# EAGLE design Ee_33_Roco_43936_NEXT18_J1_022_02_02 (EAGLE 5.10)
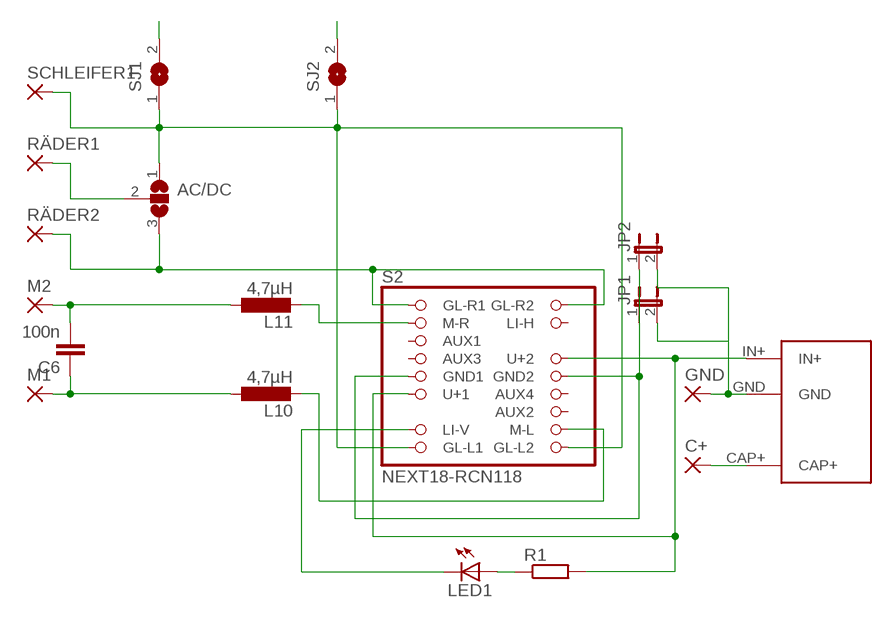
[diagram p0: schematic, sheet 1]

## Parts
AC/DC  SJ2W1  [SJ_2.1]
C6  100n  C-EUC0603K  [C0603K]
C+  1,6/0,8  [1,6/0,8]
GND  1,6/0,8  [1,6/0,8]
JP1  JP1E2,00R  [JP1_2R]
JP2  JP1E2,00R  [JP1_2R]
L10  4,7µH  L-EUL1212W  [L1212W]
L11  4,7µH  L-EUL1212W  [L1212W]
LED1  LEDCHIPLED_0603  [CHIPLED_0603]
M1  SMD-LONG2,54-5,08  [SMD2,54-5,08]
M2  SMD-LONG2,54-5,08  [SMD2,54-5,08]
R1  R-EU_R0603  [R0603]
RÄDER1  SMD-LONG1,27-2,54  [SMD1,27-2,54]
RÄDER2  SMD-LONG1,27-2,54  [SMD1,27-2,54]
S2  NEXT18-RCN118  [NEXT18]
SCHLEIFER1  SMD-LONG1,27-2,54  [SMD1,27-2,54]
SJ1  SJSS  [SJSS]
SJ2  SJSS  [SJSS]
U$1  PWR_CAPTS  [POWER_CAP_S]

## Nets
BL: L10.2 S2.P11(M-L)
N$1: C6.1 L10.1 M1.1(P)
N$2: C6.2 L11.1 M2.1(P)
N$3: JP1.1 JP2.1 S2.P5(GND1) S2.P14(GND2)
N$4: R1.2 S2.P6(U+1) S2.P15(U+2) U$1.IN+
N$5: L11.2 S2.P2(M-R)
N$6: GND.1(P) JP1.2 JP2.2 U$1.GND
N$7: LED1.A R1.1
N$8: C+.1(P) U$1.CAP+
N$9: LED1.C S2.P8(LI-V)
RÄDER1: AC/DC.2 RÄDER1.1(P)
RÄDER2: AC/DC.3 RÄDER2.1(P) S2.P1(GL-R1) S2.P18(GL-R2)
SCHLEIFER: AC/DC.1 S2.P9(GL-L1) S2.P10(GL-L2) SCHLEIFER1.1(P) SJ1.1 SJ2.1
SCHLEIFER1: SJ1.2
SCHLEIFER2: SJ2.2
Unconnected: S2.P3(AUX1) S2.P4(AUX3) S2.P12(AUX2) S2.P13(AUX4) S2.P17(LI-H)

## Library data of the parts
AC/DC = jumper:SJ2
C6 = rcl:C-EU: CAPACITOR, European symbol
C+ GND = wirepad:1,6/0,8: THROUGH-HOLE PAD
JP1 JP2 = jumper:JP1E: JUMPER
L10 L11 = rcl:L-EU: INDUCTOR, European symbol
LED1 = led:LED: LED OSRAM: - CHIPLED LG R971, LG N971, LY N971, LG Q971, LY Q971, LO R971, LY R971 LH N974, LH R974 LS Q976, LO Q976, LY Q976 LO Q996 - Hyper CHIPLED LW Q18S LB Q993, LB Q99A, LB R99A - SideLED LS A670, LO A670, LY A670, LG A670, LP A670 LB A673, LV A673, LT A673, LW A673 LH A674 LY A675 LS A676, LA A676, LO A676, LY A676, LW A676 LS A679, LY A679, LG A679 - Hyper Micro SIDELED® LS Y876, LA Y876, LO Y876, LY Y876 LT Y87S - SmartLED LW L88C, LW L88S LB L89C, LB L89S, LG L890 LS L89K, LO L89K, LY L89K LS L896, LA L896, LO L896, LY L896 - TOPLED LS T670, LO T670, LY T670, LG T670, LP T670 LSG T670, LSP T670, LSY T670, LOP T670, LYG T670 LG T671, LOG T671, LSG T671 LB T673, LV T673, LT T673, LW T673 LH T674 LS T676, LA T676, LO T676, LY T676, LB T676, LH T676, LSB T676, LW T676 LB T67C, LV T67C, LT T67C, LS T67K, LO T67K, LY T67K, LW E67C LS E67B, LA E67B, LO E67B, LY E67B, LB E67C, LV E67C, LT E67C LW T67C LS T679, LY T679, LG T679 LS T770, LO T770, LY T770, LG T770, LP T770 LB T773, LV T773, LT T773, LW T773 LH T774 LS E675, LA E675, LY E675, LS T675 LS T776, LA T776, LO T776, LY T776, LB T776 LHGB T686 LT T68C, LB T68C - Hyper Mini TOPLED® LB M676 - Mini TOPLED Santana® LG M470 LS M47K, LO M47K, LY M47K Source: http://www.osram.convergy.de LUXEON: - LUMILED® LXK2-PW12-R00, LXK2-PW12-S00, LXK2-PW14-U00, LXK2-PW14-V00 LXK2-PM12-R00, LXK2-PM12-S00, LXK2-PM14-U00 LXK2-PE12-Q00, LXK2-PE12-R00, LXK2-PE12-S00, LXK2-PE14-T00, LXK2-PE14-U00 LXK2-PB12-K00, LXK2-PB12-L00, LXK2-PB12-M00, LXK2-PB14-N00, LXK2-PB14-P00, LXK2-PB14-Q00 LXK2-PR12-L00, LXK2-PR12-M00, LXK2-PR14-Q00, LXK2-PR14-R00 LXK2-PD12-Q00, LXK2-PD12-R00, LXK2-PD12-S00 LXK2-PH12-R00, LXK2-PH12-S00 LXK2-PL12-P00, LXK2-PL12-Q00, LXK2-PL12-R00 Source: www.luxeon.com KINGBRIGHT: KA-3528ASYC Source: www.kingbright.com
M1 M2 RÄDER1 RÄDER2 SCHLEIFER1 = wirepad:SMD-LONG
R1 = rcl:R-EU_: RESISTOR, European symbol
S2 = pinhead:NEXT18
SJ1 SJ2 = jumper:SJ: SMD solder JUMPER
U$1 = pinhead:PWR_CAP

## Board
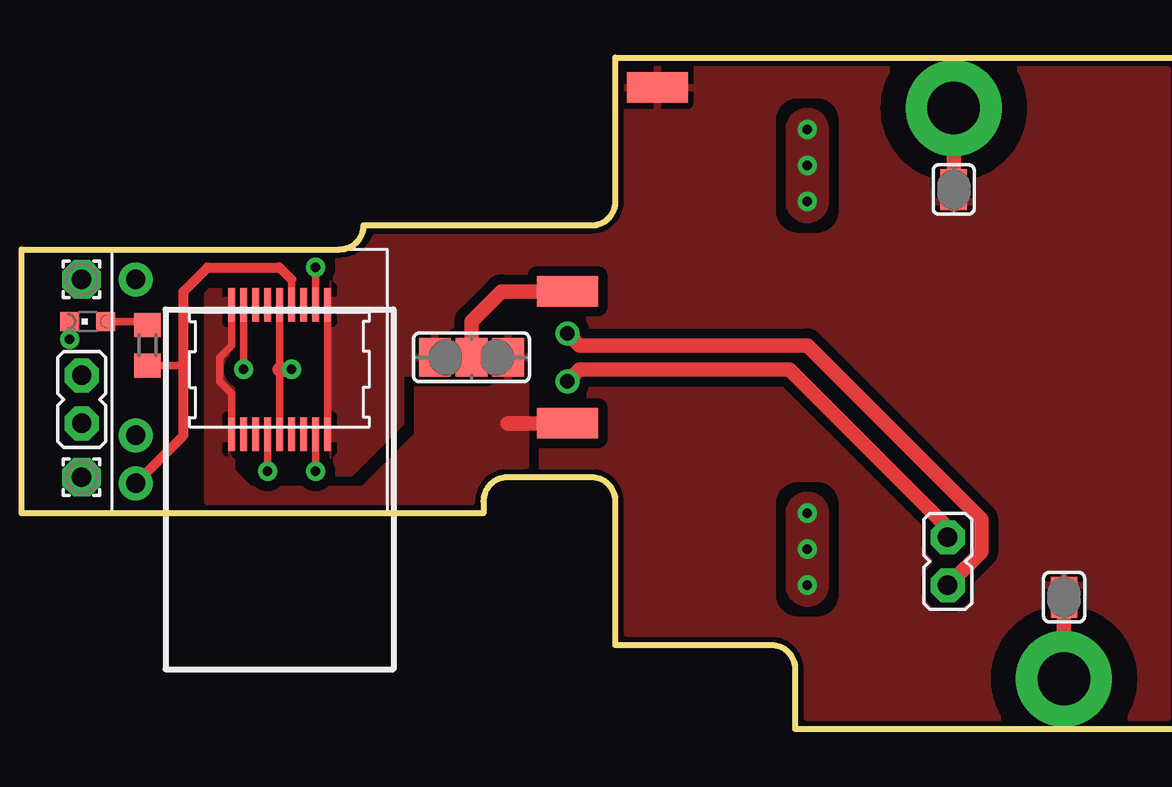
[diagram p1: board, top side]
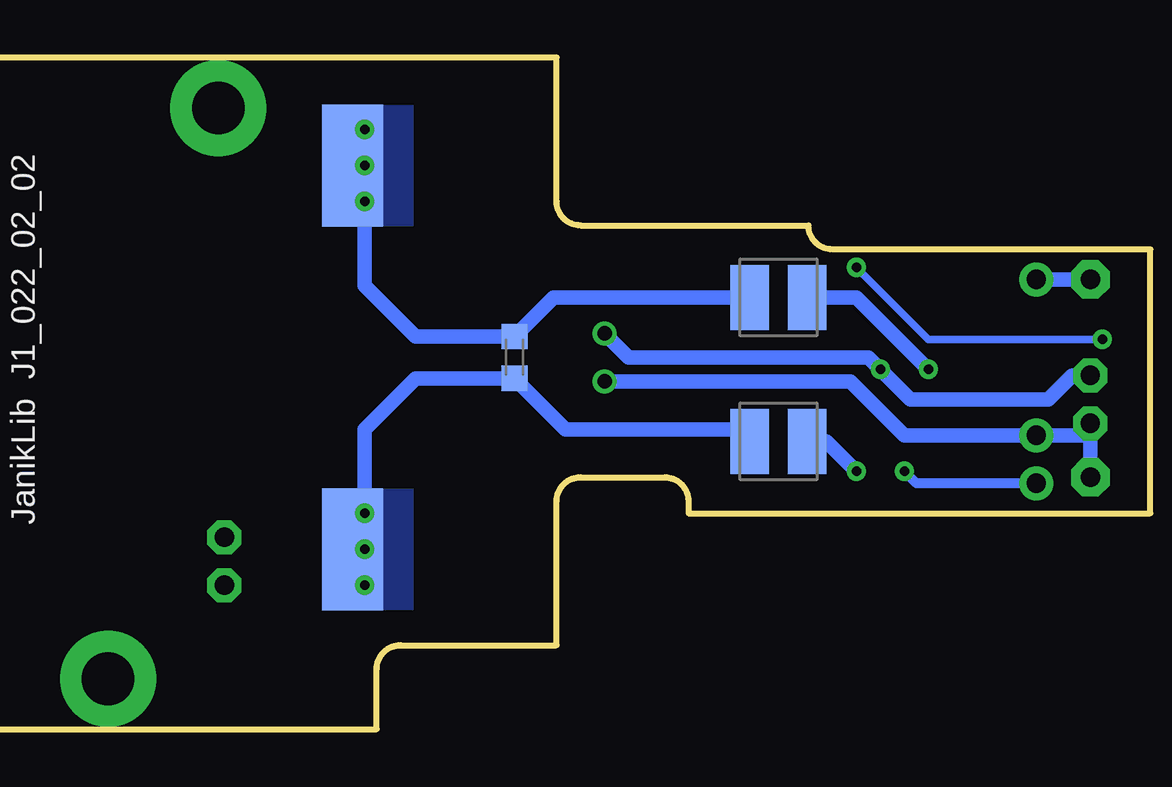
[diagram p2: board, bottom side, seen from below]

No outline drawn. Coordinates in mm, seen from the top.
Copper layers (1*16): Top 0.035mm / dielectric 1.5mm / Bottom 0.035mm
Design rules "default *": minimum track width 10mil, minimum drill 0.4mm, track to track 8mil, track to pad 8mil, pad to pad 8mil, via to via 8mil, smd to smd 8mil, copper to edge 40mil, drill to drill 8mil, minimum pad ring 10mil, minimum via ring 8mil, stop-mask expansion 4mil, vias tented up to drill 0mil, thermal gap 10mil
bKeepout: area 46.8,4 to 48.2,24; area 29.2,9 to 46.8,22; area 1.2,12.5 to 29.2,17.5
tRestrict: area 41,-0.4 to 46,4.6; area 36.4,23.4 to 41.4,28.4; area 11.2,13.2 to 12.2,16.8
Milling: 18 lines

### Footprints (pad centres in the part's own frame; a part is rotated, then mirrored left to right if it is on the bottom)
SJ_2.1 = smd 1.321 x 1.6: 1 -1.524,0; 2 0,0; 3 1.524,0
C0603K = smd 1.05 x 1.08: 1 -0.875,0; 2 0.875,0
1,6/0,8 = drill 0.813 pad 1.6 octagon: 1 0,0
JP1_2R = drill 0.8 pad 1.422 octagon: 1 0,-1; 2 0,1
L1212W = smd 1.6 x 2.7: 1 -1.2,0; 2 1.2,0
CHIPLED_0603 = smd 0.8 x 0.8: A 0,-0.75; C 0,0.75
SMD2,54-5,08 = smd 2.54 x 5.08: 1 0,0
R0603 = smd 1 x 1.1: 1 -0.85,0; 2 0.85,0
SMD1,27-2,54 = smd 1.27 x 2.54: 1 0,0
NEXT18 = smd 0.3 x 1.4: P1 -2,2.7; P2 -1.5,2.7; P3 -1,2.7; P4 -0.5,2.7; P5 0,2.7; P6 0.5,2.7; P7 1,2.7; P8 1.5,2.7; P9 2,2.7; P10 2,-2.7; P11 1.5,-2.7; P12 1,-2.7; P13 0.5,-2.7; P14 0,-2.7; P15 -0.5,-2.7; P16 -1,-2.7; P17 -1.5,-2.7; P18 -2,-2.7
SJSS = smd 0.7 x 1.1: 1 -0.5,0; 2 0.5,0
POWER_CAP_S = drill 0.8 pad 1.422 round: CAP+ 0,-6.5; GND 0,0; IN+ 0,2

### Placement (x,y rotation side)
AC/DC  18.75,15.5 0 top
C6  26.5,15.5 90 bottom
C+  2.5,18.75 0 top
GND  2.5,10.5 0 top
JP1  2.5,13.75 180 top
JP2  38.6,7 0 top
L10  15.5,12 0 bottom
L11  15.5,18 0 bottom
LED1  2.75,17 90 top
M1  33.25,7.5 0 bottom
M2  33.25,23.5 0 bottom
R1  5.25,16 270 top
RÄDER1  22.75,18.25 270 top
RÄDER2  22.75,12.75 90 top
S2  10.75,15 0 top
SCHLEIFER1  26.5,26.75 270 top
SJ1  43.45,5.5 270 top
SJ2  38.85,22.5 90 top
U$1  4.75,12.25 180 top

### Tracks (layer width: path | path; a pad name or v marks a point on that pad's centre or on a via)
BL  (via drill 0.4)
  Top 0.305: S2.P11 v12.25,10.75
  Bottom 0.61: v12.25,10.75 13.5,12 L10.2
N$1  (via drill 0.4)
  Bottom 0.61: v32.75,7.5 v32.75,9 32.75,12.5 30.62,14.62 C6.1 24.38,12.5 17.2,12.5 L10.1 | v32.75,7.5 v32.75,6 | v32.75,7.5 M1.1
  pour Top: 32,9 arc-90 32.75,9.75 arc-90 33.5,9 33.5,6 arc-90 32.75,5.25 arc-90 32,6
  pour Bottom (no thermals): 32.25,10 30.75,10 30.75,5 32.25,5
N$2  (via drill 0.4)
  Bottom 0.61: 32.75,23 v32.75,22 32.75,18.5 30.62,16.38 C6.2 24.88,18 L11.1 | 32.75,23 v32.75,23.5 v32.75,25 | 32.75,23 M2.1
  pour Top: 33.5,25 arc90 32.75,25.75 arc90 32,25 32,22 arc90 32.75,21.25 arc90 33.5,22
  pour Bottom (no thermals): 32.25,26 30.75,26 30.75,21 32.25,21
N$3  (via drill 0.4, 0.6)
  Top 0.305: S2.P14 10.75,15 S2.P5
  Top 0.61: v11.25,15 10.75,15 | v22.75,16.5 23.25,16 32.75,16 40,8.75 40,7.4 JP2.1
  Bottom 0.61: JP1.1 3.25,14.75 4.25,13.75 10,13.75 v11.25,15 11.75,15.5 21.75,15.5 v22.75,16.5
N$4  (via drill 0.4)
  Top 0.305: v10.25,10.75 S2.P15 | 11.25,18.75 S2.P6 | 6.75,15.15 R1.2
  Top 0.406: 11.25,18.75 10.75,19.25 7.75,19.25 6.75,18.25 6.75,15.15 6.75,12.25 U$1.IN+
  Bottom 0.406: v10.25,10.75 9.75,10.25 U$1.IN+
N$5  (via drill 0.4)
  Top 0.305: v9.25,15 S2.P2
  Bottom 0.61: L11.2 12.25,18 v9.25,15
N$6  (via drill 0.6)
  Top 0.61: v22.75,14.5 23.25,15 32,15 38.6,8.4 JP2.2
  Bottom 0.61: 2.5,12.25 JP1.2 | GND.1 2.5,12.25 | 2.5,12.25 U$1.GND 10.25,12.25 12.5,14.5 v22.75,14.5
N$7
  Top 0.305: LED1.A 5.1,17 R1.1
N$8
  Bottom 0.61: C+.1 U$1.CAP+
N$9  (via drill 0.4)
  Top 0.305: LED1.C v2,16.25 | v12.25,19.25 S2.P8
  Bottom 0.305: v2,16.25 9.25,16.25 v12.25,19.25
RÄDER1
  Top 0.61: RÄDER1.1 20,18.25 18.75,17 AC/DC.2
RÄDER2
  Top 0.305: S2.P1 8.75,16 8.25,15.5 8.25,14.5 8.75,14 S2.P18
  Top 0.61: 20.25,12.75 RÄDER2.1
  pour Top (isolate 0.406): 19.75,16.25 21,16.25 21,11 20.25,11 arc90 18.75,9.5 7.75,9.5 7.75,18.25 8.75,18.25 8.75,10.75 9.5,10 14.25,10 16.5,12.25 16.5,14.25 19.75,14.25
  pour Top (no thermals): 8.75,12.12 8.75,12.38 7.75,12.38 7.75,12.12
  pour Top (no thermals): 8.75,17.62 8.75,17.88 7.75,17.88 7.75,17.62
SCHLEIFER
  Top 0.305: S2.P10 S2.P9
  pour Top (isolate 0.406, rank 2): 47.75,27.5 25.25,27.5 25.25,22 arc-90 23.75,20.5 14.75,20.5 arc-67 13.25,19.5 0.5,19.5 0.5,9.5 18.75,9.5 arc-90 20.25,11 23.75,11 arc-90 25.25,9.5 25.25,4 31.25,4 arc-90 32.75,2.5 32.75,0.5 47.75,0.5
  pour Top (no thermals): 12.75,17.88 12.75,17.62 13.75,17.62 13.75,17.88
  pour Top (no thermals): 12.75,12.38 12.75,12.12 13.75,12.12 13.75,12.38
SCHLEIFER1  (via drill 2.2 pad 4)
  Top 0.61: v43.45,2.1 SJ1.2
SCHLEIFER2  (via drill 2.2 pad 4)
  Top 0.61: SJ2.2 v38.85,25.9

### Text on the board
bNames: JanikLib J1_022_02_02
tStop: Schleifer | AC | design by Janik Merz | Roco Ee3/3 | Rad1 | 43529/43936 | NEXT18 | DC | AC | Rad2 | AC
Measures: Dicke = 1,0mm